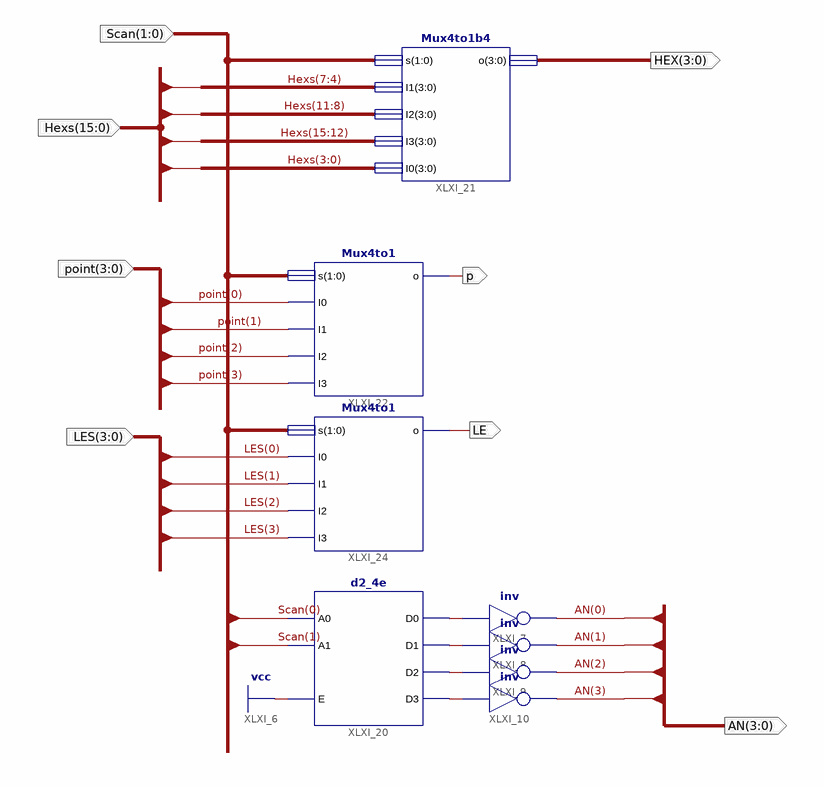
[diagram p0: schematic sheet 1]
// Xilinx ISE schematic DisplaySync.sch (kintex7) as structural Verilog: 8 symbols, 8 ports
module DisplaySync (
  input  [15:0] Hexs,
  input  [3:0] point,
  input  [1:0] Scan,
  input  [3:0] LES,
  output [3:0] HEX,
  output p,
  output LE,
  output [3:0] AN
);

  wire XLXN_27, XLXN_28, XLXN_29, XLXN_30;

  not XLXI_7 (AN[0], XLXN_27);
  not XLXI_8 (AN[1], XLXN_28);
  not XLXI_9 (AN[2], XLXN_29);
  not XLXI_10 (AN[3], XLXN_30);
  d2_4e XLXI_20 (.A0(Scan[0]), .A1(Scan[1]), .E(1'b1), .D0(XLXN_27), .D1(XLXN_28), .D2(XLXN_29), .D3(XLXN_30));
  Mux4to1b4 XLXI_21 (.s(Scan), .I1(Hexs[7:4]), .I2(Hexs[11:8]), .I3(Hexs[15:12]), .I0(Hexs[3:0]), .o(HEX));
  Mux4to1 XLXI_22 (.s(Scan), .I0(point[0]), .I1(point[1]), .I2(point[2]), .I3(point[3]), .o(p));
  Mux4to1 XLXI_24 (.s(Scan), .I0(LES[0]), .I1(LES[1]), .I2(LES[2]), .I3(LES[3]), .o(LE));
endmodule
